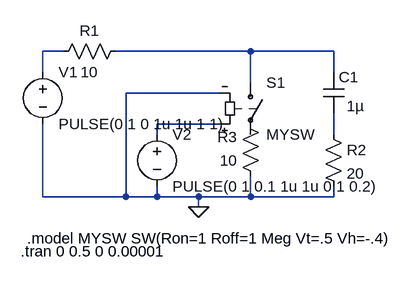
[diagram p0: schematic WithSwith.asc]
WithSwith.asc, the LTspice schematic file:
Version 4
SHEET 1 880 680
WIRE 0 0 -32 0
WIRE 288 0 80 0
WIRE 416 0 288 0
WIRE -32 32 -32 0
WIRE 416 32 416 0
WIRE 288 48 288 0
WIRE 240 64 96 64
WIRE 240 112 144 112
WIRE 144 128 144 112
WIRE 288 128 288 112
WIRE 416 128 416 96
WIRE -32 224 -32 112
WIRE 96 224 96 64
WIRE 96 224 -32 224
WIRE 144 224 144 208
WIRE 144 224 96 224
WIRE 208 224 144 224
WIRE 288 224 288 192
WIRE 288 224 208 224
WIRE 416 224 416 208
WIRE 416 224 288 224
WIRE 208 240 208 224
FLAG 208 240 0
SYMBOL res 96 -16 R90
WINDOW 0 0 56 VBottom 2
WINDOW 3 32 56 VTop 2
SYMATTR InstName R1
SYMATTR Value 10
SYMBOL res 304 208 R180
WINDOW 0 36 76 Left 2
WINDOW 3 36 40 Left 2
SYMATTR InstName R3
SYMATTR Value 10
SYMBOL cap 400 32 R0
WINDOW 3 36 52 Left 2
SYMATTR InstName C1
SYMATTR Value 1µ
SYMBOL voltage -32 16 R0
WINDOW 123 0 0 Left 0
WINDOW 39 0 0 Left 0
SYMATTR InstName V1
SYMATTR Value PULSE(0 1 0 1u 1u 1 1)
SYMBOL voltage 144 112 R0
WINDOW 123 0 0 Left 0
WINDOW 39 0 0 Left 0
SYMATTR InstName V2
SYMATTR Value PULSE(0 1 0.1 1u 1u 0.1 0.2)
SYMBOL sw 288 32 R0
SYMATTR InstName S1
SYMATTR Value MYSW
SYMBOL res 400 112 R0
SYMATTR InstName R2
SYMATTR Value 20
TEXT -56 288 Left 2 !.model MYSW SW(Ron=1 Roff=1 Meg Vt=.5 Vh=-.4)
TEXT -66 308 Left 2 !.tran 0 0.5 0 0.00001

The netlist it stands for:
* WithSwith.asc
R1 N002 N001 10
R3 0 N004 10
C1 N002 N005 1µ
V1 N001 0 PULSE(0 1 0 1u 1u 1 1)
V2 N003 0 PULSE(0 1 0.1 1u 1u 0.1 0.2)
S1 N002 N004 N003 0 MYSW
R2 N005 0 20
.model MYSW SW(Ron=1 Roff=1 Meg Vt=.5 Vh=-.4)
.tran 0 0.5 0 0.00001
.backanno
.end